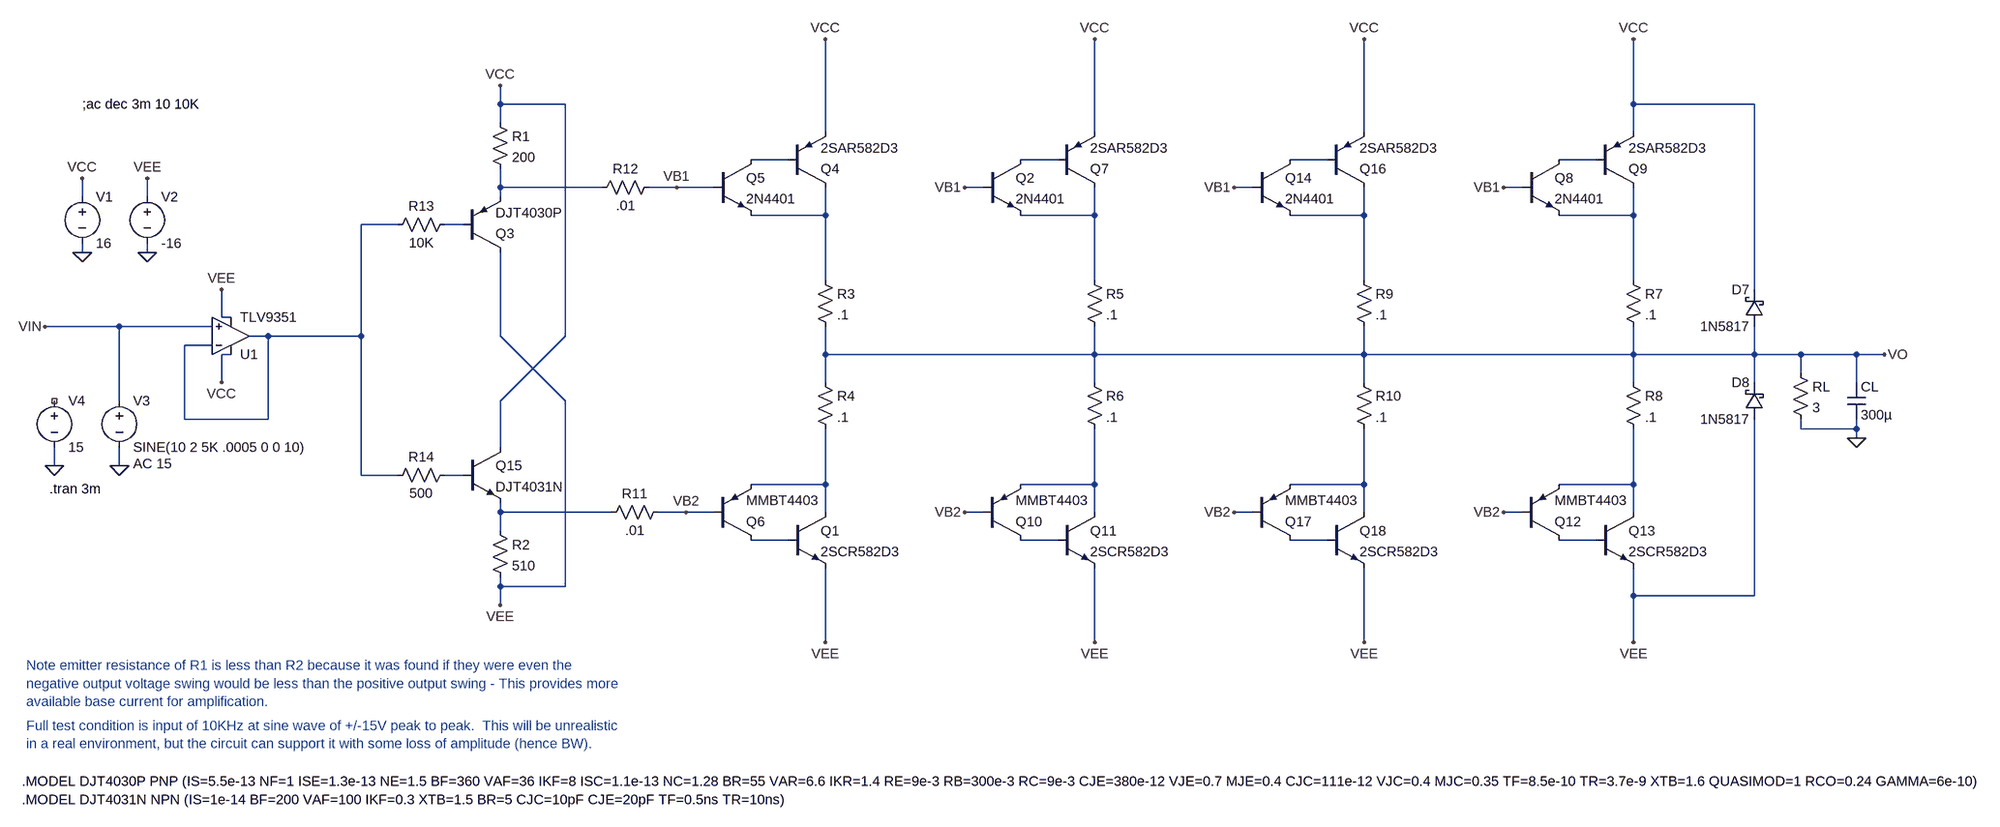
[diagram p0: schematic Current Amplifier-1_REV_21.asc]
Current Amplifier-1_REV_21.asc, the LTspice schematic file:
Version 4
SHEET 1 3356 1336
WIRE 80 -128 80 -160
WIRE 192 -128 80 -128
WIRE 2032 -128 2032 -240
WIRE 2240 -128 2032 -128
WIRE 80 -96 80 -128
WIRE 640 -80 640 -240
WIRE 1104 -80 1104 -240
WIRE 1568 -80 1568 -240
WIRE 2032 -80 2032 -128
WIRE 576 -32 512 -32
WIRE 1040 -32 976 -32
WIRE 1504 -32 1440 -32
WIRE 1968 -32 1904 -32
WIRE 80 16 80 -16
WIRE 256 16 80 16
WIRE 384 16 336 16
WIRE 448 16 384 16
WIRE 912 16 880 16
WIRE 1376 16 1344 16
WIRE 1840 16 1808 16
WIRE -640 32 -640 0
WIRE -528 32 -528 0
WIRE 80 32 80 16
WIRE 640 64 640 16
WIRE 640 64 512 64
WIRE 1104 64 1104 16
WIRE 1104 64 976 64
WIRE 1568 64 1568 16
WIRE 1568 64 1440 64
WIRE 2032 64 2032 16
WIRE 2032 64 1904 64
WIRE -96 80 -160 80
WIRE 16 80 -16 80
WIRE -640 128 -640 112
WIRE -528 128 -528 112
WIRE 640 176 640 64
WIRE 1104 176 1104 64
WIRE 1568 176 1568 64
WIRE 2032 176 2032 64
WIRE 2240 192 2240 -128
WIRE -400 240 -400 192
WIRE -384 240 -400 240
WIRE -576 256 -704 256
WIRE -416 256 -576 256
WIRE -320 272 -352 272
WIRE -160 272 -160 80
WIRE -160 272 -320 272
WIRE 80 272 80 128
WIRE 192 272 192 -128
WIRE -416 288 -464 288
WIRE -384 304 -400 304
WIRE 640 304 640 256
WIRE 1104 304 1104 256
WIRE 1104 304 640 304
WIRE 1568 304 1568 256
WIRE 1568 304 1104 304
WIRE 2032 304 2032 256
WIRE 2032 304 1568 304
WIRE 2240 304 2240 256
WIRE 2240 304 2032 304
WIRE 2320 304 2240 304
WIRE 2416 304 2320 304
WIRE 2464 304 2416 304
WIRE 2320 336 2320 304
WIRE -400 352 -400 304
WIRE 640 352 640 304
WIRE 1104 352 1104 304
WIRE 1568 352 1568 304
WIRE 2032 352 2032 304
WIRE 2240 352 2240 304
WIRE 2416 352 2416 304
WIRE -576 384 -576 256
WIRE 80 384 192 272
WIRE 192 384 80 272
WIRE -464 416 -464 288
WIRE -320 416 -320 272
WIRE -320 416 -464 416
WIRE 2320 432 2320 416
WIRE 2416 432 2416 416
WIRE 2416 432 2320 432
WIRE 2416 448 2416 432
WIRE 80 464 80 384
WIRE -688 496 -688 464
WIRE -576 496 -576 464
WIRE -160 512 -160 272
WIRE -96 512 -160 512
WIRE 16 512 -16 512
WIRE 640 528 640 432
WIRE 640 528 512 528
WIRE 1104 528 1104 432
WIRE 1104 528 976 528
WIRE 1568 528 1568 432
WIRE 1568 528 1440 528
WIRE 2032 528 2032 432
WIRE 2032 528 1904 528
WIRE 80 576 80 560
WIRE 272 576 80 576
WIRE 400 576 352 576
WIRE 448 576 400 576
WIRE 640 576 640 528
WIRE 912 576 880 576
WIRE 1104 576 1104 528
WIRE 1376 576 1344 576
WIRE 1568 576 1568 528
WIRE 1840 576 1808 576
WIRE 2032 576 2032 528
WIRE 80 608 80 576
WIRE 576 624 512 624
WIRE 1040 624 976 624
WIRE 1504 624 1440 624
WIRE 1968 624 1904 624
WIRE 80 704 80 688
WIRE 192 704 192 384
WIRE 192 704 80 704
WIRE 2032 720 2032 672
WIRE 2240 720 2240 416
WIRE 2240 720 2032 720
WIRE 80 736 80 704
WIRE 640 800 640 672
WIRE 1104 800 1104 672
WIRE 1568 800 1568 672
WIRE 2032 800 2032 720
FLAG -640 0 VCC
FLAG -528 0 VEE
FLAG -640 128 0
FLAG -528 128 0
FLAG 640 -240 VCC
FLAG 640 800 VEE
FLAG -400 352 VCC
FLAG -400 192 VEE
FLAG -576 496 0
FLAG 2416 448 0
FLAG 2464 304 VO
FLAG -704 256 VIN
FLAG 80 -160 VCC
FLAG 80 736 VEE
FLAG 1104 -240 VCC
FLAG 1104 800 VEE
FLAG 384 16 VB1
FLAG 400 576 VB2
FLAG 880 16 VB1
FLAG 880 576 VB2
FLAG 2032 -240 VCC
FLAG 2032 800 VEE
FLAG 1808 16 VB1
FLAG 1808 576 VB2
FLAG -688 496 0
FLAG 1568 -240 VCC
FLAG 1568 800 VEE
FLAG 1344 16 VB1
FLAG 1344 576 VB2
SYMBOL voltage -640 16 R0
WINDOW 123 0 0 Left 0
WINDOW 39 0 0 Left 0
SYMATTR InstName V1
SYMATTR Value 16
SYMBOL voltage -528 16 R0
WINDOW 123 0 0 Left 0
WINDOW 39 0 0 Left 0
SYMATTR InstName V2
SYMATTR Value -16
SYMBOL res 624 160 R0
SYMATTR InstName R3
SYMATTR Value .1
SYMBOL res 624 336 R0
SYMATTR InstName R4
SYMATTR Value .1
SYMBOL voltage -576 368 R0
WINDOW 123 24 124 Left 2
WINDOW 39 0 0 Left 0
SYMATTR Value2 AC 15
SYMATTR InstName V3
SYMATTR Value SINE(10 2 5K .0005 0 0 10)
SYMBOL res 2304 320 R0
SYMATTR InstName RL
SYMATTR Value 3
SYMBOL cap 2400 352 R0
SYMATTR InstName CL
SYMATTR Value 300µ
SYMBOL res 64 -112 R0
SYMATTR InstName R1
SYMATTR Value 200
SYMBOL res 64 592 R0
SYMATTR InstName R2
SYMATTR Value 510
SYMBOL res 1088 160 R0
SYMATTR InstName R5
SYMATTR Value .1
SYMBOL res 1088 336 R0
SYMATTR InstName R6
SYMATTR Value .1
SYMBOL res 2016 160 R0
SYMATTR InstName R7
SYMATTR Value .1
SYMBOL res 2016 336 R0
SYMATTR InstName R8
SYMATTR Value .1
SYMBOL schottky 2256 256 R180
WINDOW 0 24 64 Left 2
WINDOW 3 24 0 Left 2
SYMATTR InstName D7
SYMATTR Value 1N5817
SYMATTR Description Diode
SYMATTR Type diode
SYMBOL schottky 2256 416 R180
WINDOW 0 24 64 Left 2
WINDOW 3 24 0 Left 2
SYMATTR InstName D8
SYMATTR Value 1N5817
SYMATTR Description Diode
SYMATTR Type diode
SYMBOL pnp 448 624 M180
SYMATTR InstName Q6
SYMATTR Value MMBT4403
SYMBOL npn 448 -32 R0
SYMATTR InstName Q5
SYMATTR Value 2N4401
SYMBOL pnp 576 16 M180
SYMATTR InstName Q4
SYMATTR Value 2SAR582D3
SYMBOL npn 576 576 R0
SYMATTR InstName Q1
SYMATTR Value 2SCR582D3
SYMBOL voltage -688 368 R0
WINDOW 123 0 0 Left 0
WINDOW 39 0 0 Left 0
SYMATTR InstName V4
SYMATTR Value 15
SYMBOL npn 912 -32 R0
SYMATTR InstName Q2
SYMATTR Value 2N4401
SYMBOL pnp 1040 16 M180
SYMATTR InstName Q7
SYMATTR Value 2SAR582D3
SYMBOL npn 1840 -32 R0
SYMATTR InstName Q8
SYMATTR Value 2N4401
SYMBOL pnp 1968 16 M180
SYMATTR InstName Q9
SYMATTR Value 2SAR582D3
SYMBOL pnp 912 624 M180
SYMATTR InstName Q10
SYMATTR Value MMBT4403
SYMBOL npn 1040 576 R0
SYMATTR InstName Q11
SYMATTR Value 2SCR582D3
SYMBOL pnp 1840 624 M180
SYMATTR InstName Q12
SYMATTR Value MMBT4403
SYMBOL npn 1968 576 R0
SYMATTR InstName Q13
SYMATTR Value 2SCR582D3
SYMBOL res 1552 160 R0
SYMATTR InstName R9
SYMATTR Value .1
SYMBOL res 1552 336 R0
SYMATTR InstName R10
SYMATTR Value .1
SYMBOL npn 1376 -32 R0
SYMATTR InstName Q14
SYMATTR Value 2N4401
SYMBOL pnp 1504 16 M180
SYMATTR InstName Q16
SYMATTR Value 2SAR582D3
SYMBOL pnp 1376 624 M180
SYMATTR InstName Q17
SYMATTR Value MMBT4403
SYMBOL npn 1504 576 R0
SYMATTR InstName Q18
SYMATTR Value 2SCR582D3
SYMBOL res 368 560 R90
WINDOW 0 0 56 VBottom 2
WINDOW 3 32 56 VTop 2
SYMATTR InstName R11
SYMATTR Value .01
SYMBOL res 352 0 R90
WINDOW 0 0 56 VBottom 2
WINDOW 3 32 56 VTop 2
SYMATTR InstName R12
SYMATTR Value .01
SYMBOL Hab_OpAmp\\TLV9351 -384 336 M180
SYMATTR InstName U1
SYMBOL res 0 64 R90
WINDOW 0 0 56 VBottom 2
WINDOW 3 32 56 VTop 2
SYMATTR InstName R13
SYMATTR Value 10K
SYMBOL res 0 496 R90
WINDOW 0 0 56 VBottom 2
WINDOW 3 32 56 VTop 2
SYMATTR InstName R14
SYMATTR Value 500
SYMBOL npn 16 464 R0
SYMATTR InstName Q15
SYMATTR Value DJT4031N
SYMBOL pnp 16 128 M180
SYMATTR InstName Q3
SYMATTR Value DJT4030P
TEXT -696 536 Left 2 !.tran 3m
TEXT -640 -128 Left 2 !;ac dec 3m 10 10K
TEXT -736 840 Left 2 ;Note emitter resistance of R1 is less than R2 because it was found if they were even the\nnegative output voltage swing would be less than the positive output swing - This provides more \navailable base current for amplification.
TEXT -736 944 Left 2 ;Full test condition is input of 10KHz at sine wave of +/-15V peak to peak.  This will be unrealistic\nin a real environment, but the circuit can support it with some loss of amplitude (hence BW).
TEXT -744 1040 Left 2 !.MODEL DJT4030P PNP (IS=5.5e-13 NF=1 ISE=1.3e-13 NE=1.5 BF=360 VAF=36 IKF=8 ISC=1.1e-13 NC=1.28 BR=55 VAR=6.6 IKR=1.4 RE=9e-3 RB=300e-3 RC=9e-3 CJE=380e-12 VJE=0.7 MJE=0.4 CJC=111e-12 VJC=0.4 MJC=0.35 TF=8.5e-10 TR=3.7e-9 XTB=1.6 QUASIMOD=1 RCO=0.24 GAMMA=6e-10)\n.MODEL DJT4031N NPN (IS=1e-14 BF=200 VAF=100 IKF=0.3 XTB=1.5 BR=5 CJC=10pF CJE=20pF TF=0.5ns TR=10ns)

The netlist it stands for:
* Current Amplifier-1_REV_21.asc
V1 VCC 0 16
V2 VEE 0 -16
R3 N006 VO .1
R4 VO N013 .1
V3 VIN 0 SINE(10 2 5K .0005 0 0 10) AC 15
RL VO 0 3
CL VO 0 300µ
R1 VCC N005 200
R2 N017 VEE 510
R5 N007 VO .1
R6 VO N014 .1
R7 N009 VO .1
R8 VO N016 .1
D7 VO VCC 1N5817
D8 VEE VO 1N5817
Q6 N018 VB2 N013 0 MMBT4403
Q5 N001 VB1 N006 0 2N4401
Q4 N006 N001 VCC 0 2SAR582D3
Q1 N013 N018 VEE 0 2SCR582D3
V4 NC_01 0 15
Q2 N002 VB1 N007 0 2N4401
Q7 N007 N002 VCC 0 2SAR582D3
Q8 N004 VB1 N009 0 2N4401
Q9 N009 N004 VCC 0 2SAR582D3
Q10 N019 VB2 N014 0 MMBT4403
Q11 N014 N019 VEE 0 2SCR582D3
Q12 N021 VB2 N016 0 MMBT4403
Q13 N016 N021 VEE 0 2SCR582D3
R9 N008 VO .1
R10 VO N015 .1
Q14 N003 VB1 N008 0 2N4401
Q16 N008 N003 VCC 0 2SAR582D3
Q17 N020 VB2 N015 0 MMBT4403
Q18 N015 N020 VEE 0 2SCR582D3
R11 VB2 N017 .01
R12 VB1 N005 .01
* U1: TLV9351 (symbol Hab_OpAmp\TLV9351 not available, pins judged from their places): In+=VIN In-=N010 V+=VCC V-=VEE OUT=N010
R13 N011 N010 10K
R14 N012 N010 500
Q15 VCC N012 N017 0 DJT4031N
Q3 VEE N011 N005 0 DJT4030P
.model D D
.lib standard.dio
.model NPN NPN
.model PNP PNP
.lib standard.bjt
.tran 3m
;ac dec 3m 10 10K
* Note emitter resistance of R1 is less than R2 because it was found if they were even the
* negative output voltage swing would be less than the positive output swing - This provides more
* available base current for amplification.
* Full test condition is input of 10KHz at sine wave of +/-15V peak to peak.  This will be unrealistic
* in a real environment, but the circuit can support it with some loss of amplitude (hence BW).
.MODEL DJT4030P PNP (IS=5.5e-13 NF=1 ISE=1.3e-13 NE=1.5 BF=360 VAF=36 IKF=8 ISC=1.1e-13 NC=1.28 BR=55 VAR=6.6 IKR=1.4 RE=9e-3 RB=300e-3 RC=9e-3 CJE=380e-12 VJE=0.7 MJE=0.4 CJC=111e-12 VJC=0.4 MJC=0.35 TF=8.5e-10 TR=3.7e-9 XTB=1.6 QUASIMOD=1 RCO=0.24 GAMMA=6e-10)
.MODEL DJT4031N NPN (IS=1e-14 BF=200 VAF=100 IKF=0.3 XTB=1.5 BR=5 CJC=10pF CJE=20pF TF=0.5ns TR=10ns)
.backanno
.end